# EAGLE design matchbox_dpy_sm_v01 (EAGLE 7.4.0)
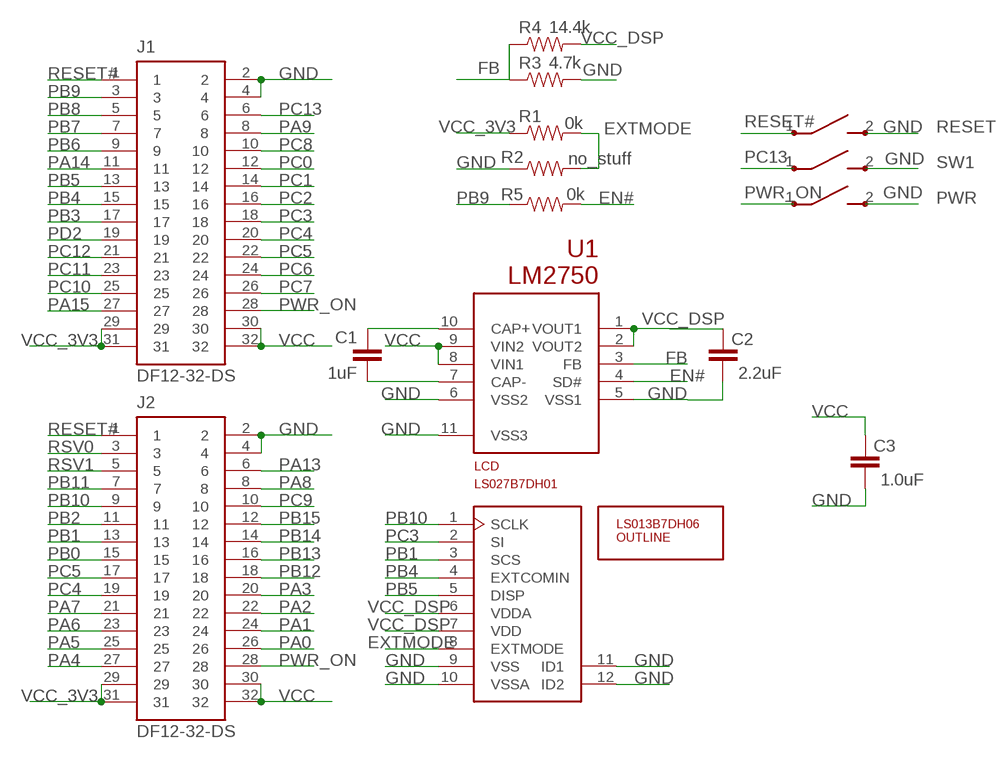
[diagram p0: schematic, sheet 1]

## Parts
C1  1uF  CAP0805  [0805]
C2  2.2uF  CAP0805  [0805]
C3  1.0uF  CAP0805  [0805]
J1  DF12-32-DS  AS-ITM-00012  [DF12-32-DS]
J2  DF12-32-DS  AS-ITM-00012  [DF12-32-DS]
LCD  LS027B7DH01  [MOLEX-51441-1093]
PWR  B3U-3100PM-B  [B3U-3100PM-B]
R1  0k  RESISTOR0805-RES  [0805]
R2  no_stuff  RESISTOR0805-RES  [0805]
R3  4.7k  RESISTOR0805-RES  [0805]
R4  14.4k  RESISTOR0805-RES  [0805]
R5  0k  RESISTOR0805-RES  [0805]
RESET  B3U-3100PM-B  [B3U-3100PM-B]
SW1  B3U-3100PM-B  [B3U-3100PM-B]
U1  LM2750  [LM2750]
U$1  LS013B7DH06-OUTLINE  [LS013B7DH06]

## Nets
EN#: R5.2 U1.4(SD#)
EXTMODE: LCD.8(EXTMODE) R1.2 R2.2
FB: R3.1 R4.1 U1.3(FB)
GND: C2.2 C3.2 J1.2 J1.4 J2.2 J2.4 LCD.9(VSS) LCD.10(VSSA) LCD.11(ID1) LCD.12(ID2) PWR.2 R2.1 R3.2 RESET.2 SW1.2 U1.5(VSS1) U1.6(VSS2) U1.11(VSS3)
N$1: C1.1 U1.10(CAP+)
N$2: C1.2 U1.7(CAP-)
PA0: J2.26
PA1: J2.24
PA2: J2.22
PA3: J2.20
PA4: J2.27
PA5: J2.25
PA6: J2.23
PA7: J2.21
PA8: J2.8
PA9: J1.8
PA13: J2.6
PA14: J1.11
PA15: J1.27
PB0: J2.15
PB1: J2.13 LCD.3(SCS)
PB2: J2.11
PB3: J1.17
PB4: J1.15 LCD.4(EXTCOMIN)
PB5: J1.13 LCD.5(DISP)
PB6: J1.9
PB7: J1.7
PB8: J1.5
PB9: J1.3 R5.1
PB10: J2.9 LCD.1(SCLK)
PB11: J2.7
PB12: J2.18
PB13: J2.16
PB14: J2.14
PB15: J2.12
PC0: J1.12
PC1: J1.14
PC2: J1.16
PC3: J1.18 LCD.2(SI)
PC4: J1.20 J2.19
PC5: J1.22 J2.17
PC6: J1.24
PC7: J1.26
PC8: J1.10
PC9: J2.10
PC10: J1.25
PC11: J1.23
PC12: J1.21
PC13: J1.6 SW1.1
PD2: J1.19
PWR_ON: J1.28 J2.28 PWR.1
RESET#: J1.1 J2.1 RESET.1
RSV0: J2.3
RSV1: J2.5
VCC: C3.1 J1.30 J1.32 J2.30 J2.32 U1.8(VIN1) U1.9(VIN2)
VCC_3V3: J1.29 J1.31 J2.29 J2.31 R1.1
VCC_DSP: C2.1 LCD.6(VDDA) LCD.7(VDD) R4.2 U1.1(VOUT1) U1.2(VOUT2)

## Power pins joined to a net without a drawn wire
GND: PWR.GND RESET.GND SW1.GND

## Library data of the parts
C1-C3 = SparkFun-Passives:CAP: Capacitor Standard 0603 ceramic capacitor, and 0.1" leaded capacitor.; MF: CORNELL DUBILIER; MPN: 106K050CS4; OC_NEWARK: 01F367
J1 J2 = micro1292:AS-ITM-00012: CONN RECEPT 32POS 3MM SMD 0.5MM; PARTNO: AS-ITM-00012
LCD = sharp_display:LS027B7DH01
PWR RESET SW1 = sharp_display:B3U-3100PM-B
R1-R5 = SparkFun-Passives:RESISTOR: Resistor Basic schematic elements and footprints for 0603, 1206, and PTH resistors.
U1 = sharp_display:LM2750
U$1 = sharp_display:LS013B7DH06-OUTLINE

## Board
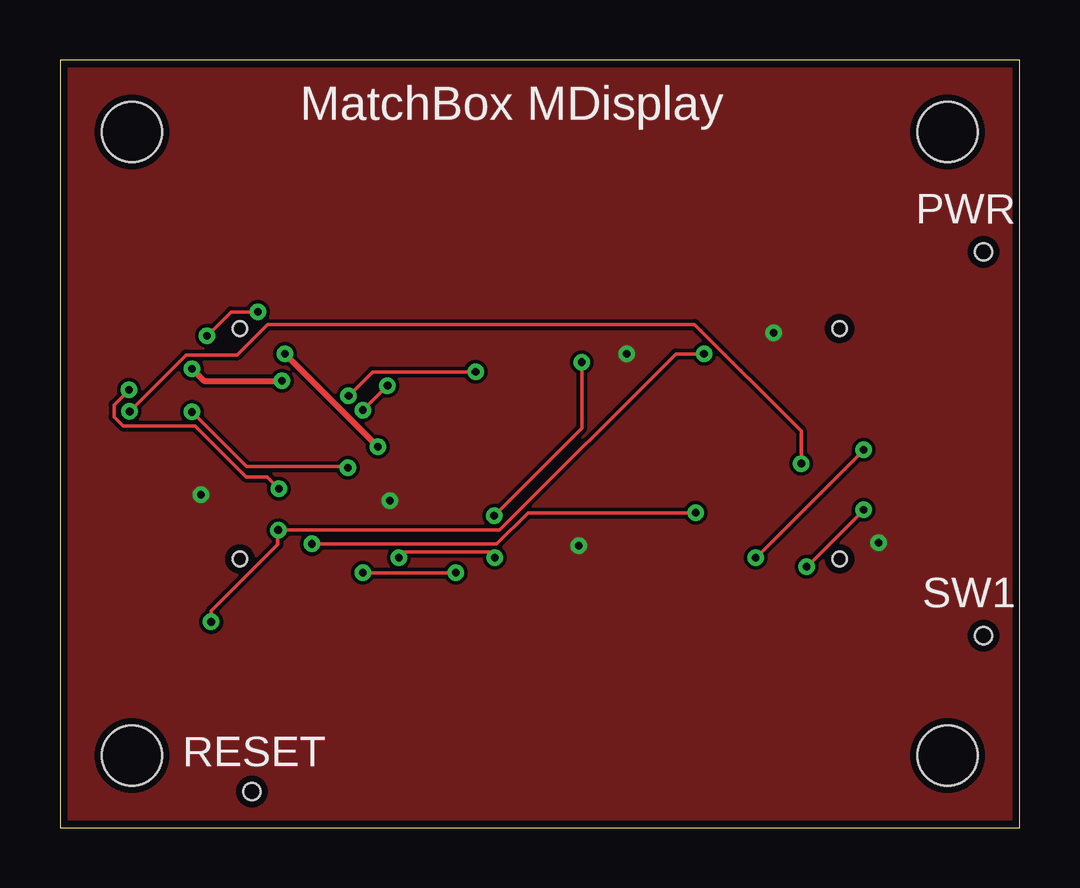
[diagram p1: board, top side]
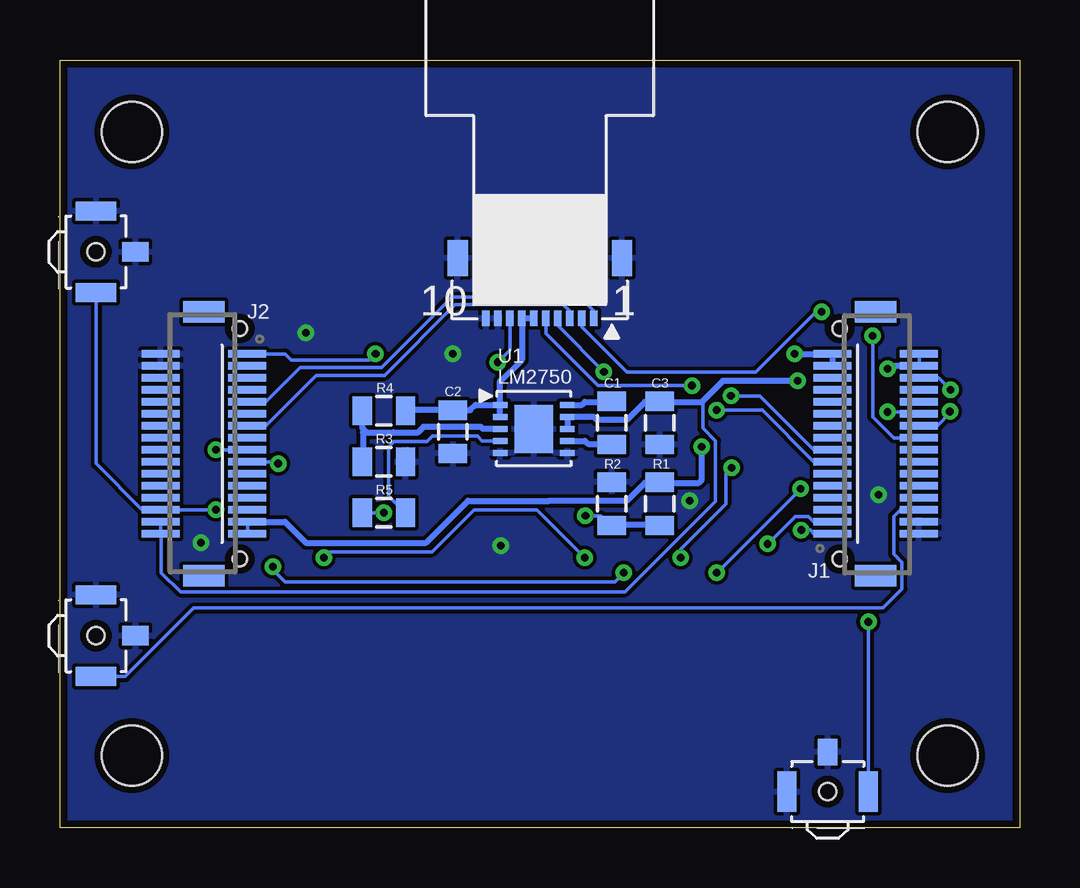
[diagram p2: board, bottom side, seen from below]

Size 40 x 32 mm. Coordinates in mm from the lower left corner, seen from the top.
Outline: 0,0 40,0 40,32 0,32 0,0
Copper layers (1*16): Top 0.0356mm / dielectric 1.5011mm / Bottom 0.0356mm
Design rules "LaenPCBOrder (2) *": minimum track width 6mil, minimum drill 13mil, track to track 6mil, track to pad 6mil, pad to pad 6mil, via to via 6mil, smd to smd 6mil, copper to edge 12mil, drill to drill 6mil, minimum pad ring 7mil, minimum via ring 7mil, stop-mask expansion 14mil, vias tented up to drill 14mil, thermal gap 6mil
Holes 2.5 mm at 3,29 37,29 37,3 3,3

### Footprints (pad centres in the part's own frame; a part is rotated, then mirrored left to right if it is on the bottom)
0805 = smd 0.8 x 1.2: 1 -0.9,0; 2 0.9,0
DF12-32-DS = smd 0.3 x 1.6: 1 -3.75,1.8; 2 -3.75,-1.8; 3 -3.25,1.8; 4 -3.25,-1.8; 5 -2.75,1.8; 6 -2.75,-1.8; 7 -2.25,1.8; 8 -2.25,-1.8; 9 -1.75,1.8; 10 -1.75,-1.8; 11 -1.25,1.8; 12 -1.25,-1.8; 13 -0.75,1.8; 14 -0.75,-1.8; 15 -0.25,1.8; 16 -0.25,-1.8; 17 0.25,1.8; 18 0.25,-1.8; 19 0.75,1.8; 20 0.75,-1.8; 21 1.25,1.8; 22 1.25,-1.8; 23 1.75,1.8; 24 1.75,-1.8; 25 2.25,1.8; 26 2.25,-1.8; 27 2.75,1.8; 28 2.75,-1.8; 29 3.25,1.8; 30 3.25,-1.8; 31 3.75,1.8; 32 3.75,-1.8 | smd 0.889 x 1.727: F1 -5.5,0; F2 5.5,0 | hole 0.6: -4.8,1.5; 4.8,1.5
MOLEX-51441-1093 = smd 0.3 x 0.65: 1 -2.25,3.275; 2 -1.75,3.275; 3 -1.25,3.275; 4 -0.75,3.275; 5 -0.25,3.275; 6 0.25,3.275; 7 0.75,3.275; 8 1.25,3.275; 9 1.75,3.275; 10 2.25,3.275 | smd 0.85 x 1.5: 11 -3.425,0.75; 12 3.425,0.75
B3U-3100PM-B = smd 0.8 x 1.7: 1 -1.7,0; 2 1.7,0 | smd 0.8 x 1.1: GND 0,-1.65 | hole 0.7: 0,0
LM2750 = smd 0.25 x 0.6: 1 -1,-1.4; 2 -0.5,-1.4; 3 0,-1.4; 4 0.5,-1.4; 5 1,-1.4; 6 1,1.4; 7 0.5,1.4; 8 0,1.4; 9 -0.5,1.4; 10 -1,1.4 | smd 2 x 1.6: 11 0,0

### Placement (x,y rotation side)
C1  17,16.88 270 bottom
C2  23.62,16.5 270 bottom
C3  15,16.88 270 bottom
J1  6,16 90 bottom
J2  34,16 270 bottom
LCD  20,24.5 180 bottom
PWR  38.5,24 90 bottom
R1  15,13.5 270 bottom
R2  17,13.5 270 bottom
R3  26.5,15.25 0 bottom
R4  26.5,17.38 0 bottom
R5  26.5,13.12 0 bottom
RESET  8,1.5 180 bottom
SW1  38.5,8 90 bottom
U1  20.25,16.62 270 bottom
U$1  20,35.5 0 bottom  (outside the outline)

### Tracks (layer width: path | path; a pad name or v marks a point on that pad's centre or on a via)
EN#
  Bottom 0.152: U1.4 22.4,16.12 22.6,16.32 24.48,16.32 24.7,16.1 25.07,16.1 25.12,16.1 25.6,16.1 25.68,16.1 26.07,16.1 26.3,15.88 26.3,15.6 26.3,15.53 26.3,14.62 26.3,14.55 26.3,13.82 R5.2
EXTMODE  (via drill 0.33)
  Top 0.152: v21.75,19.4 21.75,16.65 v18.1,13
  Bottom 0.152: LCD.8 21.25,19.9 v21.75,19.4 | v18.1,13 17.45,13 17.12,12.68 R2.2
  Bottom 0.254: R2.2 17,12.62 15,12.62 R1.2
FB
  Bottom 0.254: U1.3 22.38,16.62 22.45,16.7 24.85,16.7 25.07,16.48 26.07,16.48 26.1,16.48 27.23,16.48 | 27.23,16.48 27.4,16.65 R4.1 | R3.1 27.38,15.25 27.38,16.48 27.23,16.48
GND  (via drill 0.33)
  other vias: 29.75,20.62 23.62,19.75 21.62,11.75 5.88,13.88 13.75,13.62 34.12,11.88
  pour Top: 0,0 40,0 40,32 0,32
  pour Bottom: 0,0 40,0 40,32 0,32
N$1
  Bottom 0.254: C1.1 17,17.75 18.12,17.75 18.25,17.62 18.75,17.62 U1.10
N$2
  Bottom 0.254: C1.2 17,16 18,16 18.12,16.12 18.75,16.12 U1.7
PB1
  Bottom 0.152: LCD.3 18.75,21.52 19.02,21.8 23.52,21.8 26.48,18.85 29.32,18.85 31.43,16.75 32.17,16.75 J2.13
PB4  (via drill 0.33)
  Top 0.152: v17.32,19 13.03,19 v12.03,18
  Bottom 0.152: LCD.4 19.25,20.93 v17.32,19 | v12.03,18 10.82,18 8.57,15.75 7.83,15.75 J1.15
PB5  (via drill 0.33)
  Top 0.152: v12.62,17.4 v13.65,18.43
  Bottom 0.152: LCD.5 19.75,20.6 17.57,18.43 v13.65,18.43 | v12.62,17.4 10.72,17.4 8.57,15.25 7.83,15.25 J1.13
PB9  (via drill 0.33)
  Top 0.152: v26.5,13.12 19.5,13.12 18.2,11.82 v10.5,11.82
  Bottom 0.152: v26.5,13.12 R5.1 | v10.5,11.82 9.35,12.97 8.8,12.97 8.57,12.75 7.83,12.75 J1.3
PB10
  Bottom 0.152: LCD.1 17.75,21.52 18.35,22.12 23.65,22.12 26.6,19.18 30,19.18 31.43,17.75 32.17,17.75 J2.9
PC3  (via drill 0.33)
  Top 0.152: v8.25,21.5 7.12,21.5 v6.12,20.5
  Bottom 0.152: LCD.2 18.25,21.12 18.25,20.88 16.38,19 11.12,19 11,19 8.5,21.5 v8.25,21.5 | v6.12,20.5 6.12,17.12 5.25,16.25 4.25,16.25 J1.18
PC4  (via drill 0.33)
  Top 0.152: v30.9,15.18 30.9,16.52 26.45,20.98 8.65,20.98 7.38,19.7 5.25,19.7 v2.9,17.35
  Bottom 0.152: v30.9,15.18 30.98,15.25 32.17,15.25 J2.19 | v2.9,17.35 2.9,17.27 3.42,16.75 4.17,16.75 J1.20
PC5  (via drill 0.33)
  Top 0.152: v5.5,17.32 7.78,15.05 12,15.05 v12,15 | v33.5,15.75 v29,11.25 | v18.12,11.25 17.88,11.5 14.38,11.5 v14.12,11.25
  Bottom 0.152: v5.5,17.32 4.28,17.32 J1.22 | J1.22 | v29,11.25 28.75,11.5 24.5,11.5 22.75,13.25 20.12,13.25 19.88,13 v18.12,11.25 | v33.5,15.75 32.25,15.75 J2.17 | v14.12,11.25 14.12,11.62 12.25,13.5 12.25,14.75 v12,15
PC13
  Bottom 0.152: J1.6 4.97,13.25 5.25,12.97 5.25,11.4 4.9,11.05 4.9,9.95 5.7,9.15 34.42,9.15 37.27,6.3 SW1.1 | J1.6
PWR_ON  (via drill 0.33)
  Top 0.152: v33.5,13.25 v31.12,10.88 | v12.62,10.62 v16.5,10.62 | v9.12,14.12 8.62,14.62 7.75,14.62 5.62,16.75 2.62,16.75 2.25,17.12 2.25,17.62 v2.88,18.25
  Bottom 0.152: PWR.1 38.5,15.18 36.58,13.25 35.83,13.25 J2.28 35.75,13.25 v33.5,13.25 | v31.12,10.88 31.12,10.75 30.62,10.25 16.88,10.25 v16.5,10.62 | v9.12,14.12 v12.62,10.62 | v2.88,18.25 3.38,18.75 4.12,18.75 J1.28
RESET#  (via drill 0.33)
  Top 0.152: v26.85,19.75 25.68,19.75 18.32,12.4 v9.1,12.4 9.07,12.32 9.07,11.8 6.3,9.03 v6.3,8.57
  Bottom 0.152: v9.1,12.4 8.72,12.4 8.57,12.25 7.83,12.25 J1.1 | 32.17,19.75 J2.1 | v6.3,8.57 RESET.1 | 26.88,19.75 v26.85,19.75 26.88,19.75 | 32.12,19.75 J2.1 | 26.88,19.75 27.12,19.5 30.12,19.5 30.38,19.5 30.62,19.75 32.12,19.75 | 32.12,19.75 J2.1
VCC  (via drill 0.33)
  Top 0.254: v9.25,18.62 6,18.62 v5.5,19.12
  Bottom 0.152: J1.32 4.17,19.75 4.17,19.38 J1.30 | J2.30 J2.32 | J2.32 | J2.30 | 13.25,17.75 13.2,17.7 13.2,16.65 12.68,16.12 12.68,13.6 16.45,9.82 34.98,9.82 35.77,10.62 35.77,12.18 J2.32
  Bottom 0.254: U1.8 U1.9 18.75,17.12 17.75,17.12 17.62,17 16.38,17 15.62,17.75 15,17.75 C3.1 14.88,17.75 13.25,17.75 12.38,18.62 v9.25,18.62 | v5.5,19.12 5.38,19.25 4.25,19.25 J1.30
VCC_3V3  (via drill 0.33)
  Top 0.254: v13.25,15.88 v9.38,19.75
  Bottom 0.152: J2.31 32.17,12.25 32.17,12.62 J2.29
  Bottom 0.254: J1.29 J1.31 7.88,19.75 v9.38,19.75 | J2.29 32.12,12.75 30.62,12.75 29.75,11.88 24.75,11.88 23,13.62 19.62,13.62 16.38,13.62 15.62,14.38 15,14.38 R1.1 14.88,14.38 13.38,14.38 13.25,14.5 v13.25,15.88
VCC_DSP
  Bottom 0.254: U1.2 U1.1 | U1.1 21.77,17.62 22.68,17.62 22.9,17.4 C2.1 25.57,17.4 R4.2 | 21.65,18.6 21.65,18.62 21.65,18.6 | 21.65,18.6 20.75,19.5 LCD.7 LCD.6 | 21.65,18.6 21.65,17.75 U1.1

### Text on the board
tNames: MatchBox MDisplay